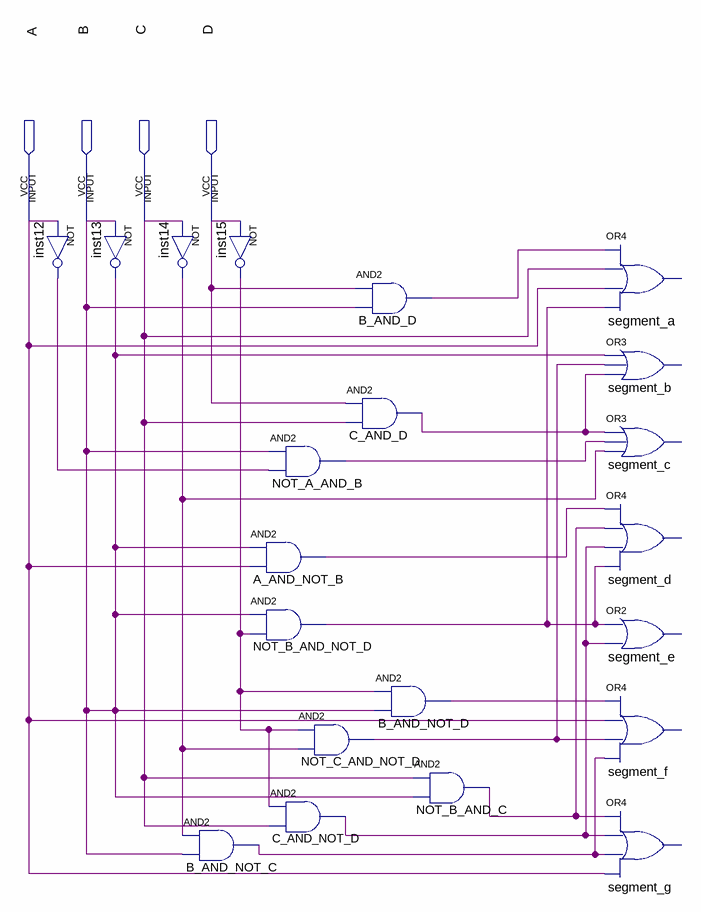
[diagram p0: schematic sheet]
// Quartus schematic seven_segment_display_decoder.bdf as structural Verilog: 21 symbols, 4 pins
module seven_segment_display_decoder (
  input  A,
  input  B,
  input  C,
  input  D
);

  wire A_AND_NOT_B_out, B_AND_D_out, B_AND_NOT_C_out, B_AND_NOT_D_out, C_AND_D_out, C_AND_NOT_D_out,
       inst12_out, inst14_out, inst15_out, NOT_A_AND_B_out, NOT_B_AND_C_out, NOT_B_AND_NOT_D_out,
       NOT_C_AND_NOT_D_out;

  not inst12 (inst12_out, A);
  not inst13 (B, B);
  not inst14 (inst14_out, C);
  and B_AND_NOT_C (B_AND_NOT_C_out, inst14_out, B);
  not inst15 (inst15_out, D);
  and NOT_A_AND_B (NOT_A_AND_B_out, B, inst12_out);
  and A_AND_NOT_B (A_AND_NOT_B_out, B, A);
  and NOT_B_AND_NOT_D (NOT_B_AND_NOT_D_out, B, inst15_out);
  and C_AND_NOT_D (C_AND_NOT_D_out, inst15_out, C);
  and C_AND_D (C_AND_D_out, D, C);
  and NOT_C_AND_NOT_D (NOT_C_AND_NOT_D_out, inst15_out, inst14_out);
  and B_AND_D (B_AND_D_out, D, B);
  and B_AND_NOT_D (B_AND_NOT_D_out, inst15_out, B);
  and NOT_B_AND_C (NOT_B_AND_C_out, C, B);
  // OR4 segment_a has open pins: IN1=B_AND_D_out, IN2=C, IN3=A, IN4=NOT_B_AND_NOT_D_out, OUT=open
  // OR3 segment_b has open pins: IN1=B, IN2=NOT_C_AND_NOT_D_out, IN3=C_AND_D_out, OUT=open
  // OR3 segment_c has open pins: IN1=C_AND_D_out, IN2=NOT_A_AND_B_out, IN3=inst14_out, OUT=open
  // OR4 segment_d has open pins: IN1=A_AND_NOT_B_out, IN2=NOT_B_AND_C_out, IN3=C_AND_NOT_D_out, IN4=NOT_B_AND_NOT_D_out, OUT=open
  // OR2 segment_e has open pins: IN1=NOT_B_AND_NOT_D_out, IN2=C_AND_NOT_D_out, OUT=open
  // OR4 segment_f has open pins: IN1=B_AND_NOT_D_out, IN2=A, IN3=NOT_C_AND_NOT_D_out, IN4=B_AND_NOT_C_out, OUT=open
  // OR4 segment_g has open pins: IN1=NOT_B_AND_C_out, IN2=C_AND_NOT_D_out, IN3=B_AND_NOT_C_out, IN4=A, OUT=open
endmodule
